# Altium schematic sheet LPF_ADC.SchDoc: ADC LPF
size A4; Organization: Altium Limited; Address1: L3, 12a Rodborough Rd; Address2: Frenchs Forest; Address3: NSW; Address4: Australia 2086
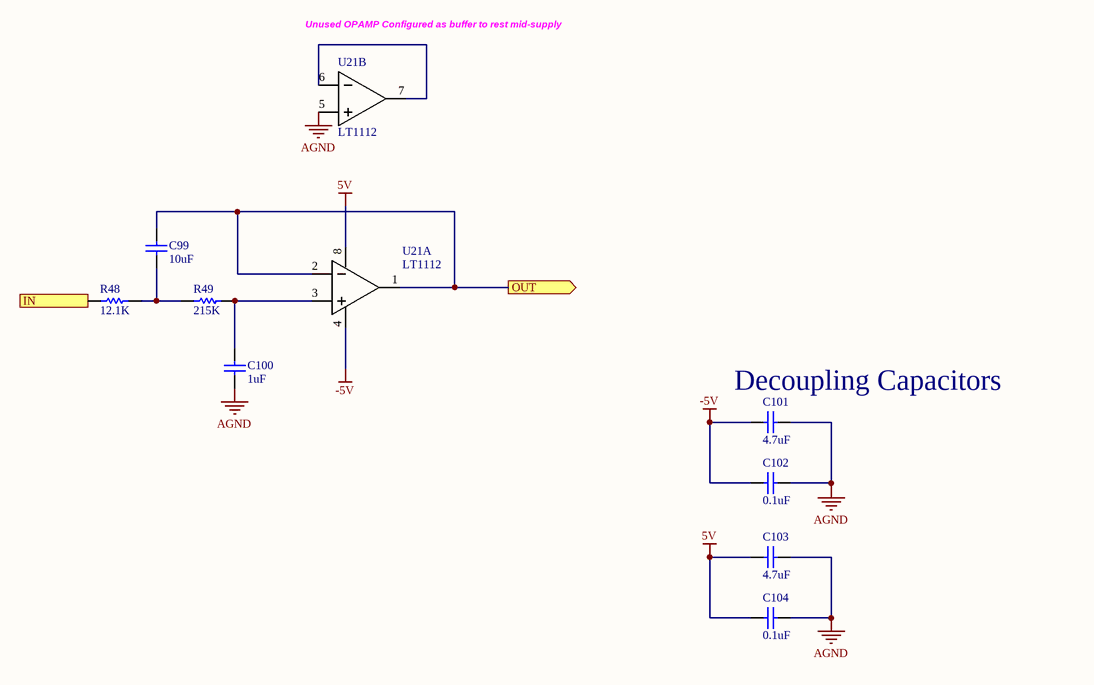
[diagram p0: LPF_ADC.SchDoc]

## Parts
C99  10uF  [0402_Cap]
C100  1uF  [0402_Cap]
C101  4.7uF  [0402_Cap]
C102  0.1uF  [0402_Cap]
C103  4.7uF  [0402_Cap]
C104  0.1uF  [0402_Cap]
R48  12.1K  [0402_Res]
R49  215K  [0402_Res]
U21  LT1112  [SOIC_8]  (parts A,B of 2)

## Ports
IN (in), OUT (out)

## Nets
5V: C103.1 C104.1 U21.8
-5V: C101.1 C102.1 U21.4
AGND: C100.1 C101.2 C102.2 C103.2 C104.2 U21.5
IN: R48.1 ; port IN
OUT: C99.2 U21.1 U21.2 ; port OUT
NetC99_1: C99.1 R48.2 R49.1
NetC100_2: C100.2 R49.2 U21.3
NetU21_6: U21.6 U21.7

## Notes on the sheet
- Unused OPAMP Configured as buffer to rest mid-supply
- (near C101) Decoupling Capacitors
- Title
- Date:
- RE:
- Arturo di Girolamo
- Size:
- A3
- A

## Library data of the parts
C99 = 08051C163JAT2A: Capacitor, 16nF, 0805, 25V; ASYPN: CL05A106MQ5NUNC; Value: 16nF; MFGPN: 08051C163JAT2A
C100 = GRM2165C2A162JA01D: Capacitor, 1.6nF, 0805, 25V; ASYPN: CL05A105KQ5NNNC; Value: 1.6nF; MFGPN: GRM2165C2A162JA01D
C101 C103 = CL21A475KAQNNNE: Capacitor, 4.7uF, 0805; Value: .01uf; ASYPN: GRM155R61A475MEAAD; MFGPN: CL21A475KAQNNNE
C102 C104 = CL21B104KACNNNC: Capacitor, 0.1uF, 0805; Value: .01uf; ASYPN: 0402YC104KAT2A; MFGPN: CL21B104KACNNNC
R48 = RC0805FR-071K65L: 1.65k; ASYPN: RMCF0402FT12K1; Value: 1.65k; MFGPN: RC0805FR-071K65L
R49 = RC0805FR-075K9L: 5.9k; ASYPN: ERJ-2RKF2153X; Value: 5.9k; MFGPN: RC0805FR-075K9L
U21 = LT1112: ASYPN: LT1112IS8#PBF